# Altium schematic sheet TopSheet.SchDoc
size A4; Author: Esteban Durán Madrid; CompanyName: Universidad de Santiago de Chile; Address1: Avenida Ecuador Nº 3519; Address2: Estación Central, Santiago; Address3: Chile; DocumentNumber: 1; SheetNumber: 1; SheetTotal: 4
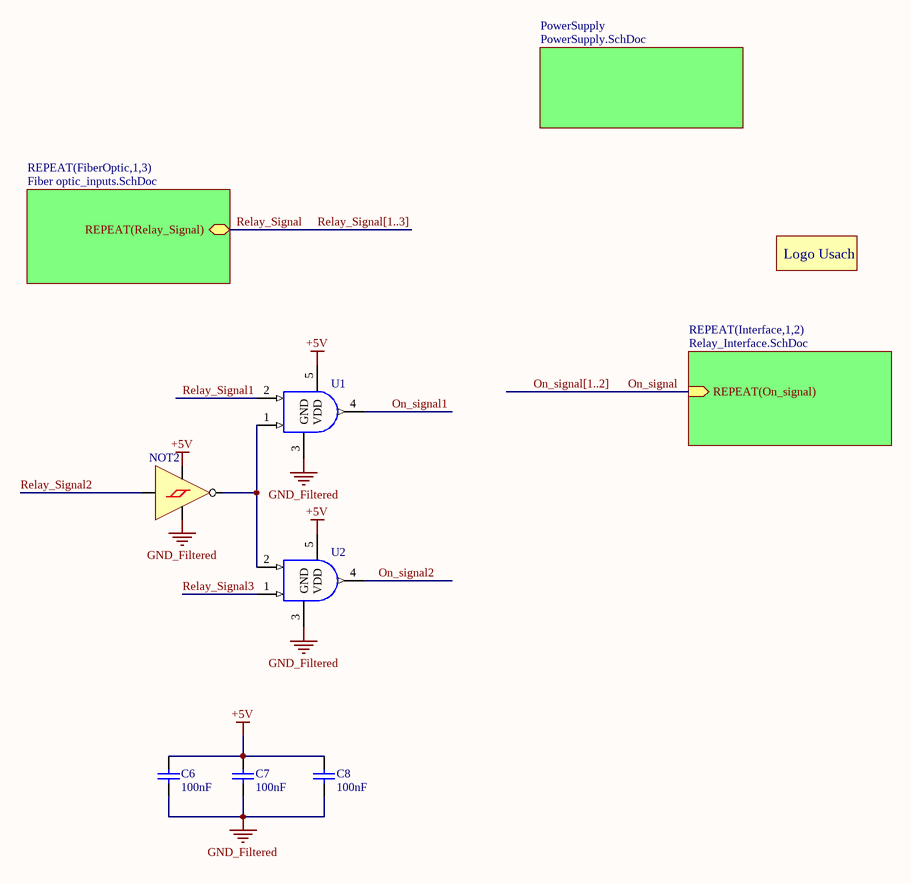
[diagram p0: TopSheet.SchDoc]

## Parts
*  LOGO USACH  [Logo Usach]  (value not drawn)  (no BOM)
C6  100nF  [CAP_0603]
C7  100nF  [CAP_0603]
C8  100nF  [CAP_0603]
NOT2  INV_CMOS  [INV_SN74AHC1G14DBVR]  (value not drawn)
U1  AND Gate  [SOT-23-5]  (value not drawn)
U2  AND Gate  [SOT-23-5]  (value not drawn)

## Sub-sheets
PowerSupply = PowerSupply.SchDoc: no entries
REPEAT(FiberOptic,1,3) = Fiber optic_inputs.SchDoc: REPEAT(Relay_Signal) (bidir)
REPEAT(Interface,1,2) = Relay_Interface.SchDoc: REPEAT(On_signal) (in)

## Nets
+5V: C6.1 C7.1 C8.1 NOT2.5(Vcc) U1.5(VDD) U2.5(VDD)
GND_Filtered: C6.2 C7.2 C8.2 NOT2.3(GND) U1.3(GND) U2.3(GND)
On_signal: sheet REPEAT(Interface,1,2)/REPEAT(On_signal)
On_signal1: U1.4(Y)
On_signal2: U2.4(Y)
Relay_Signal: sheet REPEAT(FiberOptic,1,3)/REPEAT(Relay_Signal)
Relay_Signal1: U1.2(A)
Relay_Signal2: NOT2.2(A)
Relay_Signal3: U2.1(B)
NetNOT2_4: NOT2.4(Vcc) U1.1(B) U2.2(A)

Not connected (* = marked no-connect by the designer): NOT2 1(NC)

## Buses and harness runs
bus On_signal[1..2]
bus Relay_Signal[1..3]

## Notes on the sheet
- Title
- Size:
- Date:
- A4
- Revision:
- Time:
- Sheet
- of
- Author:
- Project:
- (in symbol LOGO USACH) Logo Usach

## Library data of the parts
C6-C8 = Cap: Capacitor; Manufacturer Part-Number: LD03YC104KAB2A; Published: 8-Jun-2000; LatestRevisionDate: 17-Jul-2002; LatestRevisionNote: Re-released for DXP Platform.; PackageReference: RAD-0.3; Publisher: Altium Limited; Value: 100nF; Digikey Part-Number: 478-4929-1-ND
NOT2 = INV CMOS: Manufacturer Part-Number: SN74LVC1G14DBVR; Digikey Part-Number: 296-11607-1-ND
U1 U2 = AND Gate: 2-Input AND Gate; Manufacturer Part-Number: SN74LVC1G08DBVR; Digikey Part-Number: 296-11601-1-ND